# Altium schematic sheet tft_display.SchDoc
size A4; SheetNumber: 6; SheetTotal: 13
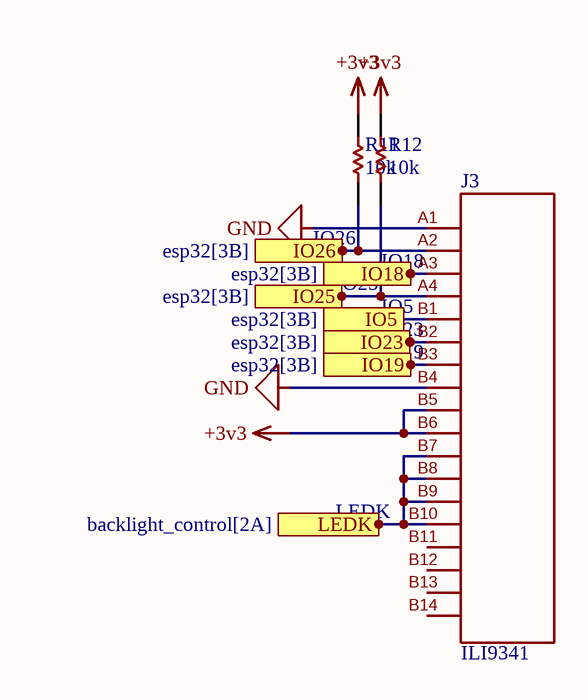
[diagram p0: tft_display.SchDoc]

## Parts
J3  ILI9341  [ILI9341]
R11  10k  [RESC2013X70X40NL20T20]
R12  10k  [RESC2013X70X40NL20T20]

## Ports
IO5 (see esp32[3B]), IO18 (see esp32[3B]), IO19 (see esp32[3B]), IO23 (see esp32[3B]), IO25 (see esp32[3B]), IO26 (see esp32[3B]), LEDK (see backlight_control[2A])

## Nets
+3v3: J3.B5(VDD) J3.B6(LEDA) R11.2 R12.2
GND: J3.A1(GND) J3.B4(GND)
IO5: J3.B1(CS) ; port IO5
IO18: J3.A3(SCL) ; port IO18
IO19: J3.B3(SDO) ; port IO19
IO23: J3.B2(SDA) ; port IO23
IO25: J3.A4(RS) R12.1 ; port IO25
IO26: J3.A2(RESET) R11.1 ; port IO26
LEDK: J3.B7(LEDK1) J3.B8(LEDK2) J3.B9(LEDK3) J3.B10(LEDK4) ; port LEDK

Not connected (* = marked no-connect by the designer): J3 B11(XL) B12(YU) B13(XR) B14(YD)

## Notes on the sheet
- IO26
- IO25
- (near J3) IO18
- (near J3) IO5
- (near J3) IO23
- (near J3) IO19
- (near J3) LEDK

## Library data of the parts
R11 R12 = CMP-2100-03671-1: Chip Resistor, 1 KOhm, +/- 1%, 125 mW, -55 to 155 degC, 0805 (2012 Metric), RoHS, Tape and Reel; Manufacturer: Yageo; Temperature Coefficient: 100ppm/degreesC; Voltage Rating (DC): 150V; Max Power Dissipation: 125mW; Resistance: 1KOhm; Number of Pins: 2; Number of Terminations: 2; Datasheet URL: http://www.yageo.com/NewPortal/yageodocoutput?fileName=/pdf/R-Chip/PYu-RC_Group_51_RoHS_L_5.pdf; Length: 0.079inch; Package Description: 2-Pin Surface Mounted Device, Body 2 x 1.25 mm; Depth: 1.25mm; Height: 0.024inch; Military Standard: Not; Case/Package: 0805; Package Reference: 0805; RoHSCompliant: true; Lead Free: LeadFree; Packaging: TapeandReel; Package Quantity: 1; Datasheet Version: Rev. 5, 10/2016; Tolerance: 1%; Min Operating Temperature: -55degC; Voltage Rating: 150V; Composition: ThickFilm; Case Code (Imperial): 0805; Power Rating: 125mW; Width: 0.049inch; Case Code (Metric): 2012; Manufacturer URL: http://www.yageo.com/; Max Operating Temperature: 155degC; REACH SVHC: Unknown; Termination: SMD/SMT